# Altium schematic sheet 指令.SchDoc
size A1 portrait
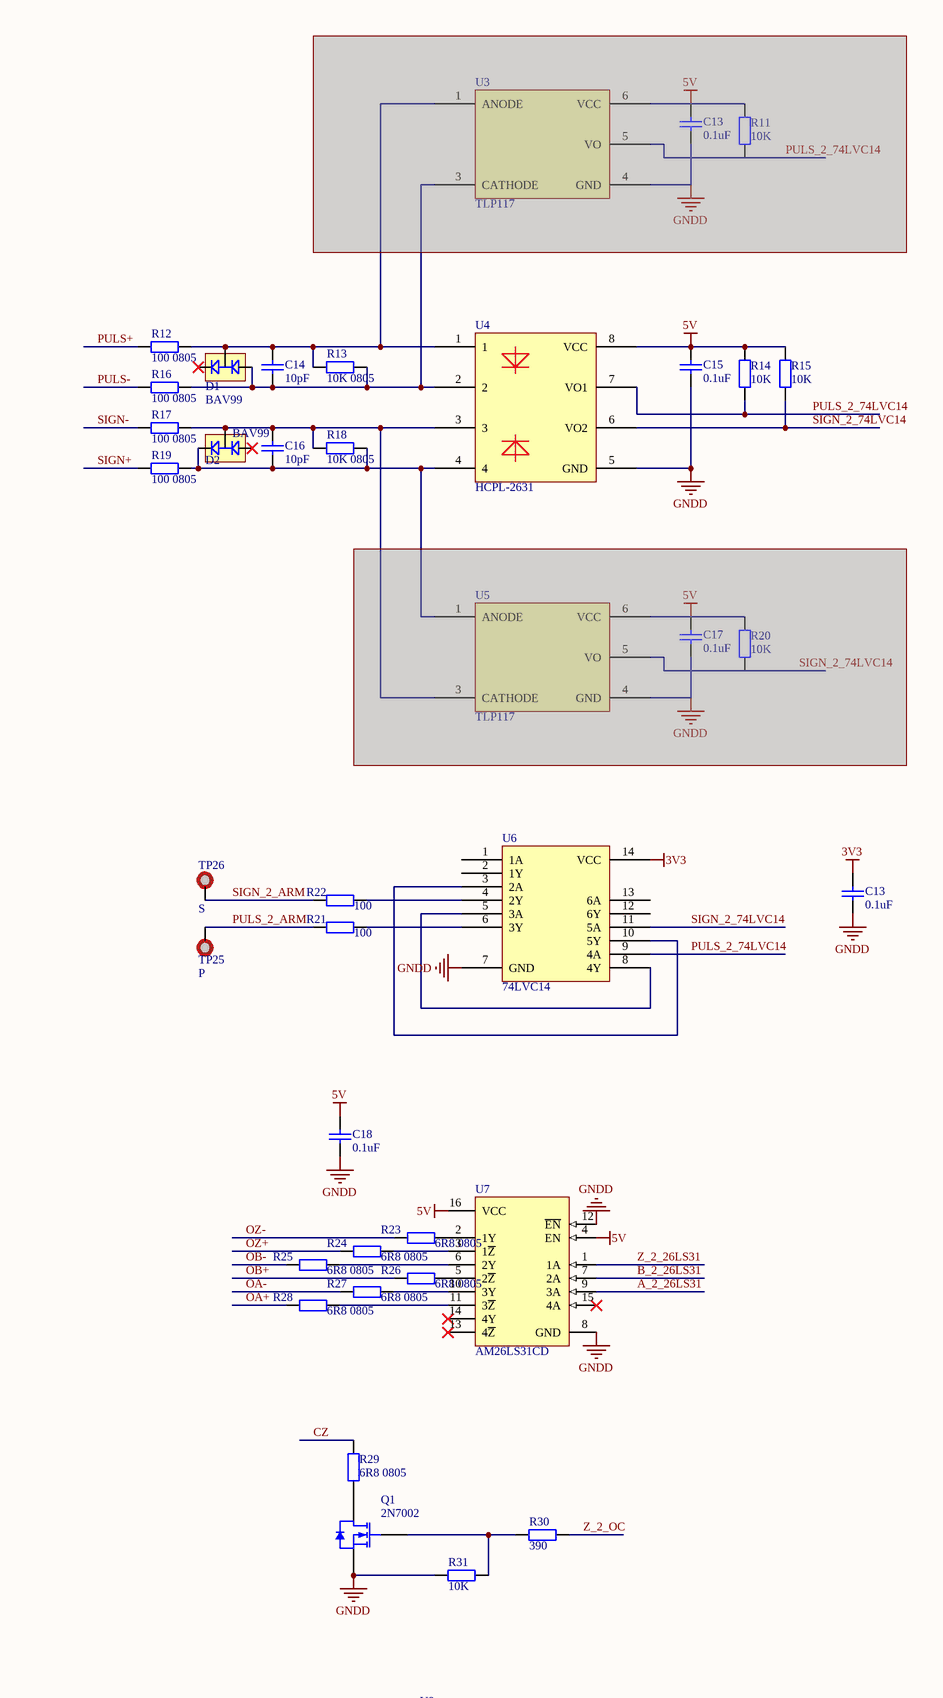
[diagram p0: 指令.SchDoc, top]
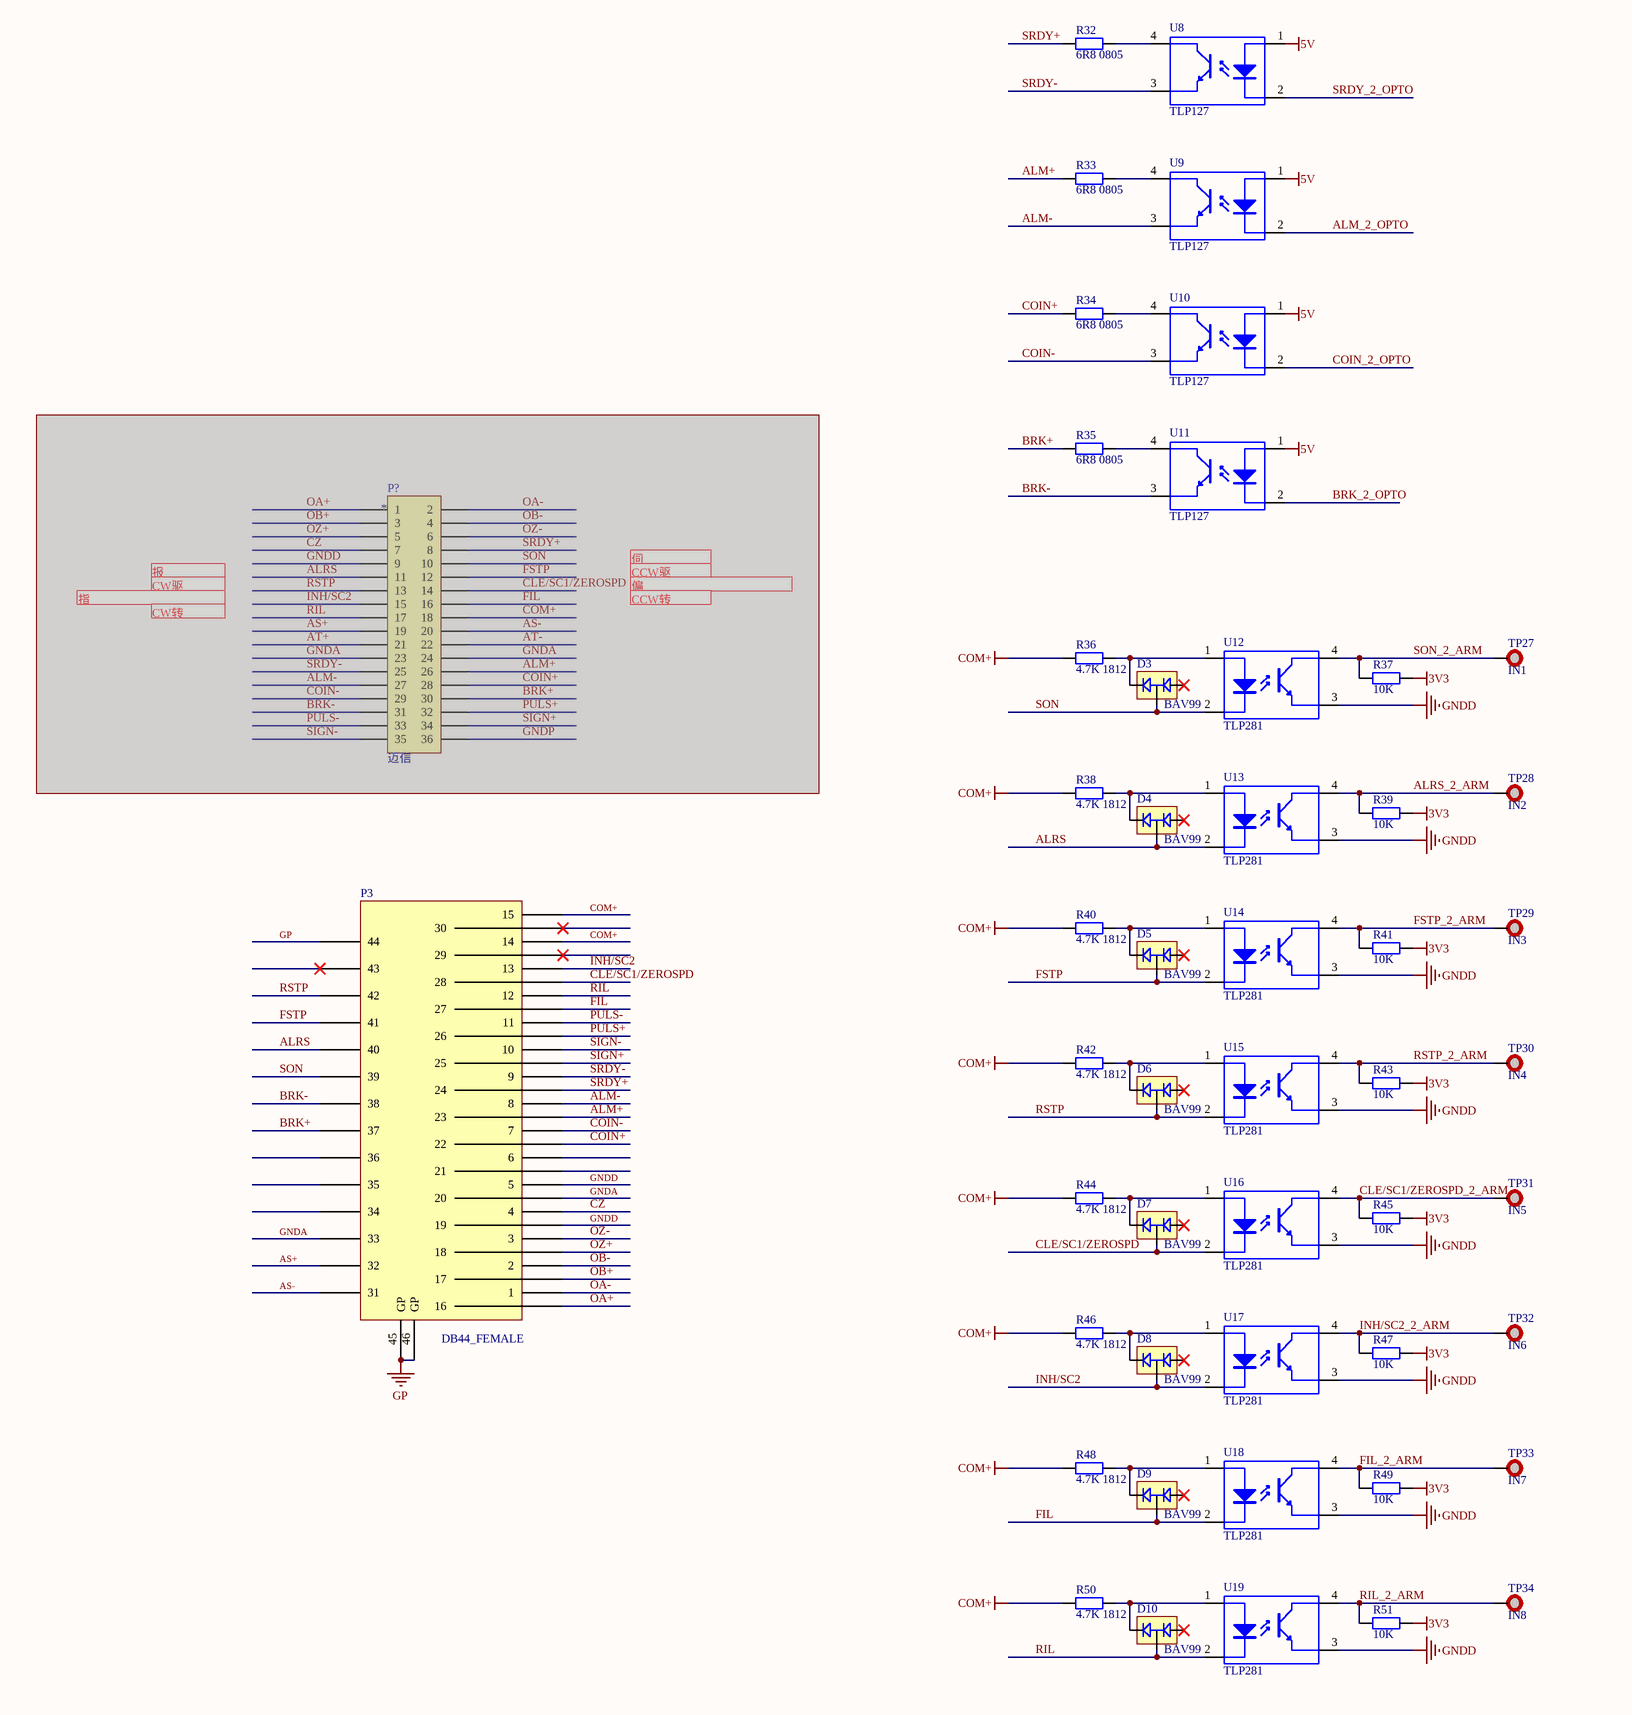
[diagram p1: 指令.SchDoc, bottom]

## Parts
(Parts that share a designator on the sheet are numbered #1, #2 ... from top to bottom, then left to right.)
C13#1  0.1uF  [C SMD 0603]  (masked out: inside a compile mask, not in the netlist)
C13#2  0.1uF  [C SMD 0603]
C14  10pF  [C SMD 0603]
C15  0.1uF  [C SMD 0603]
C16  10pF  [C SMD 0603]
C17  0.1uF  [C SMD 0603]  (masked out: inside a compile mask, not in the netlist)
C18  0.1uF  [C SMD 0603]
D1  BAV99  [SOT23]
D2  BAV99  [SOT23]
D3  BAV99  [SOT23]
D4  BAV99  [SOT23]
D5  BAV99  [SOT23]
D6  BAV99  [SOT23]
D7  BAV99  [SOT23]
D8  BAV99  [SOT23]
D9  BAV99  [SOT23]
D10  BAV99  [SOT23]
P3  DB44_FEMALE
P?  *  [AMP36_小孔小焊盘]  (masked out: inside a compile mask, not in the netlist)
Q1  2N7002  [SOT23]
R11  10K  [R SMD 0603]  (masked out: inside a compile mask, not in the netlist)
R12  100 0805  [R SMD 0805]
R13  10K 0805  [R SMD 0805]
R14  10K  [R SMD 0603]
R15  10K  [R SMD 0603]
R16  100 0805  [R SMD 0805]
R17  100 0805  [R SMD 0805]
R18  10K 0805  [R SMD 0805]
R19  100 0805  [R SMD 0805]
R20  10K  [R SMD 0603]  (masked out: inside a compile mask, not in the netlist)
R21  100  [R SMD 0603]
R22  100  [R SMD 0603]
R23  6R8 0805  [R SMD 0805]
R24  6R8 0805  [R SMD 0805]
R25  6R8 0805  [R SMD 0805]
R26  6R8 0805  [R SMD 0805]
R27  6R8 0805  [R SMD 0805]
R28  6R8 0805  [R SMD 0805]
R29  6R8 0805  [R SMD 0805]
R30  390  [R SMD 0603]
R31  10K  [R SMD 0603]
R32  6R8 0805  [R SMD 0805]
R33  6R8 0805  [R SMD 0805]
R34  6R8 0805  [R SMD 0805]
R35  6R8 0805  [R SMD 0805]
R36  4.7K 1812  [R SMD 1812]
R37  10K  [R SMD 0603]
R38  4.7K 1812  [R SMD 1812]
R39  10K  [R SMD 0603]
R40  4.7K 1812  [R SMD 1812]
R41  10K  [R SMD 0603]
R42  4.7K 1812  [R SMD 1812]
R43  10K  [R SMD 0603]
R44  4.7K 1812  [R SMD 1812]
R45  10K  [R SMD 0603]
R46  4.7K 1812  [R SMD 1812]
R47  10K  [R SMD 0603]
R48  4.7K 1812  [R SMD 1812]
R49  10K  [R SMD 0603]
R50  4.7K 1812  [R SMD 1812]
R51  10K  [R SMD 0603]
TP25  P  [测点]
TP26  S  [测点]
TP27  IN1  [测点]
TP28  IN2  [测点]
TP29  IN3  [测点]
TP30  IN4  [测点]
TP31  IN5  [测点]
TP32  IN6  [测点]
TP33  IN7  [测点]
TP34  IN8  [测点]
U3  TLP117  [TLP117]  (masked out: inside a compile mask, not in the netlist)
U4  HCPL-2631  [HCPL062N]
U5  TLP117  [TLP117]  (masked out: inside a compile mask, not in the netlist)
U6  74LVC14  [TSSOP14]
U7  AM26LS31CD  [NSO16_N]
U8  TLP127  [TLP181]
U9  TLP127  [TLP181]
U10  TLP127  [TLP181]
U11  TLP127  [TLP181]
U12  TLP281  [TLP281]
U13  TLP281  [TLP281]
U14  TLP281  [TLP281]
U15  TLP281  [TLP281]
U16  TLP281  [TLP281]
U17  TLP281  [TLP281]
U18  TLP281  [TLP281]
U19  TLP281  [TLP281]

## Nets
3V3: C13#2.1 R37.1 R39.1 R41.1 R43.1 R45.1 R47.1 R49.1 R51.1 U6.14(VCC)
5V: C15.2 C18.1 R14.2 R15.2 U4.8(VCC) U7.4(EN) U7.16(VCC) U8.1 U9.1 U10.1 U11.1
COM+: P3.14 P3.15 R36.2 R38.2 R40.2 R42.2 R44.2 R46.2 R48.2 R50.2
GNDD: C13#2.2 C15.1 C18.2 P3.5 P3.19 Q1.2(S) R31.2 U4.5(GND) U6.7(GND) U7.8(GND) U7.12(~{EN}) U12.3 U13.3 U14.3 U15.3 U16.3 U17.3 U18.3 U19.3
GP: P3.44 P3.45(GP) P3.46(GP)
A_2_26LS31: U7.9(3A)
ALM+: P3.23 R33.2
ALM-: P3.8 U9.3
ALM_2_OPTO: U9.2
ALRS: D4.3 P3.40 U13.2
ALRS_2_ARM: R39.2 TP28.1 U13.4
AS+: P3.32
AS-: P3.31
B_2_26LS31: U7.7(2A)
BRK+: P3.37 R35.2
BRK-: P3.38 U11.3
BRK_2_OPTO: U11.2
CLE/SC1/ZEROSPD: D7.3 P3.28 U16.2
CLE/SC1/ZEROSPD_2_ARM: R45.2 TP31.1 U16.4
COIN+: P3.22 R34.2
COIN-: P3.7 U10.3
COIN_2_OPTO: U10.2
CZ: P3.4 R29.1
FIL: D9.3 P3.27 U18.2
FIL_2_ARM: R49.2 TP33.1 U18.4
FSTP: D5.3 P3.41 U14.2
FSTP_2_ARM: R41.2 TP29.1 U14.4
GNDA: P3.20 P3.33
INH/SC2: D8.3 P3.13 U17.2
INH/SC2_2_ARM: R47.2 TP32.1 U17.4
OA+: P3.16 R28.2
OA-: P3.1 R27.2
OB+: P3.17 R26.2
OB-: P3.2 R25.2
OZ+: P3.18 R24.2
OZ-: P3.3 R23.2
PULS+: P3.26 R12.2
PULS-: P3.11 R16.2
PULS_2_74LVC14: R14.1 U4.7(VO1) U6.9(4A)
PULS_2_ARM: R21.1 TP25.1
RIL: D10.3 P3.12 U19.2
RIL_2_ARM: R51.2 TP34.1 U19.4
RSTP: D6.3 P3.42 U15.2
RSTP_2_ARM: R43.2 TP30.1 U15.4
SIGN+: P3.25 R19.2
SIGN-: P3.10 R17.2
SIGN_2_74LVC14: R15.1 U4.6(VO2) U6.11(5A)
SIGN_2_ARM: R22.1 TP26.1
SON: D3.3 P3.39 U12.2
SON_2_ARM: R37.2 TP27.1 U12.4
SRDY+: P3.24 R32.2
SRDY-: P3.9 U8.3
SRDY_2_OPTO: U8.2
Z_2_26LS31: U7.1(1A)
Z_2_OC: R30.2
NetC14_1: C14.1 D1.1 R13.1 R16.1 U4.2
NetC14_2: C14.2 D1.3 R12.1 R13.2 U4.1
NetC16_1: C16.1 D2.2 R18.1 R19.1 U4.4
NetC16_2: C16.2 D2.3 R17.1 R18.2 U4.3
NetD3_2: D3.2 R36.1 U12.1
NetD4_2: D4.2 R38.1 U13.1
NetD5_2: D5.2 R40.1 U14.1
NetD6_2: D6.2 R42.1 U15.1
NetD7_2: D7.2 R44.1 U16.1
NetD8_2: D8.2 R46.1 U17.1
NetD9_2: D9.2 R48.1 U18.1
NetD10_2: D10.2 R50.1 U19.1
NetQ1_1: Q1.1(G) R30.1 R31.1
NetQ1_3: Q1.3(D) R29.2
NetR21_2: R21.2 U6.6(3Y)
NetR22_2: R22.2 U6.4(2Y)
NetR23_1: R23.1 U7.2(1Y)
NetR24_1: R24.1 U7.3(1~{Z})
NetR25_1: R25.1 U7.6(2Y)
NetR26_1: R26.1 U7.5(2~{Z})
NetR27_1: R27.1 U7.10(3Y)
NetR28_1: R28.1 U7.11(3~{Z})
NetR32_1: R32.1 U8.4
NetR33_1: R33.1 U9.4
NetR34_1: R34.1 U10.4
NetR35_1: R35.1 U11.4
NetU6_3: U6.3(2A) U6.10(5Y)
NetU6_5: U6.5(3A) U6.8(4Y)

Not connected (* = marked no-connect by the designer): D1 2*; D2 1*; D3 1*; D4 1*; D5 1*; D6 1*; D7 1*; D8 1*; D9 1*; D10 1*; P3 6 21 29* 30* 34 35 36 43*; U6 1(1A) 2(1Y) 12(6Y) 13(6A); U7 13(4~{Z})* 14(4Y)* 15(4A)*

## Notes on the sheet
- 伺
- 指
- 报
- CW驱
- CW转
- CCW驱
- 偏
- CCW转
- (in symbol Header 18X2) 迈信

## Library data of the parts
C13#1 C15 C17 = Cap: Capacitor; Value: 104; Published: 8-Jun-2000; LatestRevisionDate: 17-Jul-2002; LatestRevisionNote: Re-released for DXP Platform.; PackageReference: RAD-0.3; Publisher: Altium Limited
C13#2 C18 = Cap: Capacitor; Published: 8-Jun-2000; LatestRevisionDate: 17-Jul-2002; LatestRevisionNote: Re-released for DXP Platform.; PackageReference: RAD-0.3; Publisher: Altium Limited; PackageDescription: Radial Cap, Thru-Hole; 2 Leads; 0.3 in Pin Spacing; Value: 0.1uF
C14 C16 = Cap: Capacitor; Value: 0.1uF; Published: 8-Jun-2000; LatestRevisionDate: 17-Jul-2002; LatestRevisionNote: Re-released for DXP Platform.; PackageReference: RAD-0.3; Publisher: Altium Limited; PackageDescription: Radial Cap, Thru-Hole; 2 Leads; 0.3 in Pin Spacing
P? = Header 18X2: Header, 18-Pin, Dual row; LatestRevisionDate: 17-Jul-2002; LatestRevisionNote: Re-released for DXP Platform.; Publisher: Altium Limited
R11 R13-R15 R18 R20-R22 R30 R31 R37 R39 R41 R43 R45 R47 R49 R51 = Res2: Resistor; Value: 3K; Published: 8-Jun-2000; LatestRevisionDate: 17-Jul-2002; LatestRevisionNote: Re-released for DXP Platform.; PackageReference: AXIAL-0.4; Publisher: Altium Limited
R12 R16 R17 R19 R23-R29 R32-R36 R38 R40 R42 R44 R46 R48 R50 = Res2: Resistor; Value: 1K2; Published: 8-Jun-2000; LatestRevisionDate: 17-Jul-2002; LatestRevisionNote: Re-released for DXP Platform.; PackageReference: AXIAL-0.4; Publisher: Altium Limited
TP25-TP34 = TEST_POINT
U4 = TLP521-2
U7 = AM26LS31CD: Quadruple Differential Line Driver; Published: 15-May-2002; LatestRevisionDate: 13-Apr-2006; LatestRevisionNote: IPC-7351 Footprint Added.; DatasheetVersion: May-1990; PackageVersion: Jan-1998; PackageReference: D016; Publisher: Altium Limited; PackageDescription: 16-Pin Small Outline Integrated Circuit 1.27 mm Pitch; Code_IPC: SOIC127P600-16; ComponentLink1Description: Manufacturer Link; ComponentLink1URL: http://www.ti.com/; ComponentLink2Description: Datasheet; ComponentLink2URL: http://www-s.ti.com/sc/ds/am26ls31.pdf
U8-U19 = TLP181/PC357